# EAGLE schematic rc2014_can_controller (EAGLE 7.6.0)
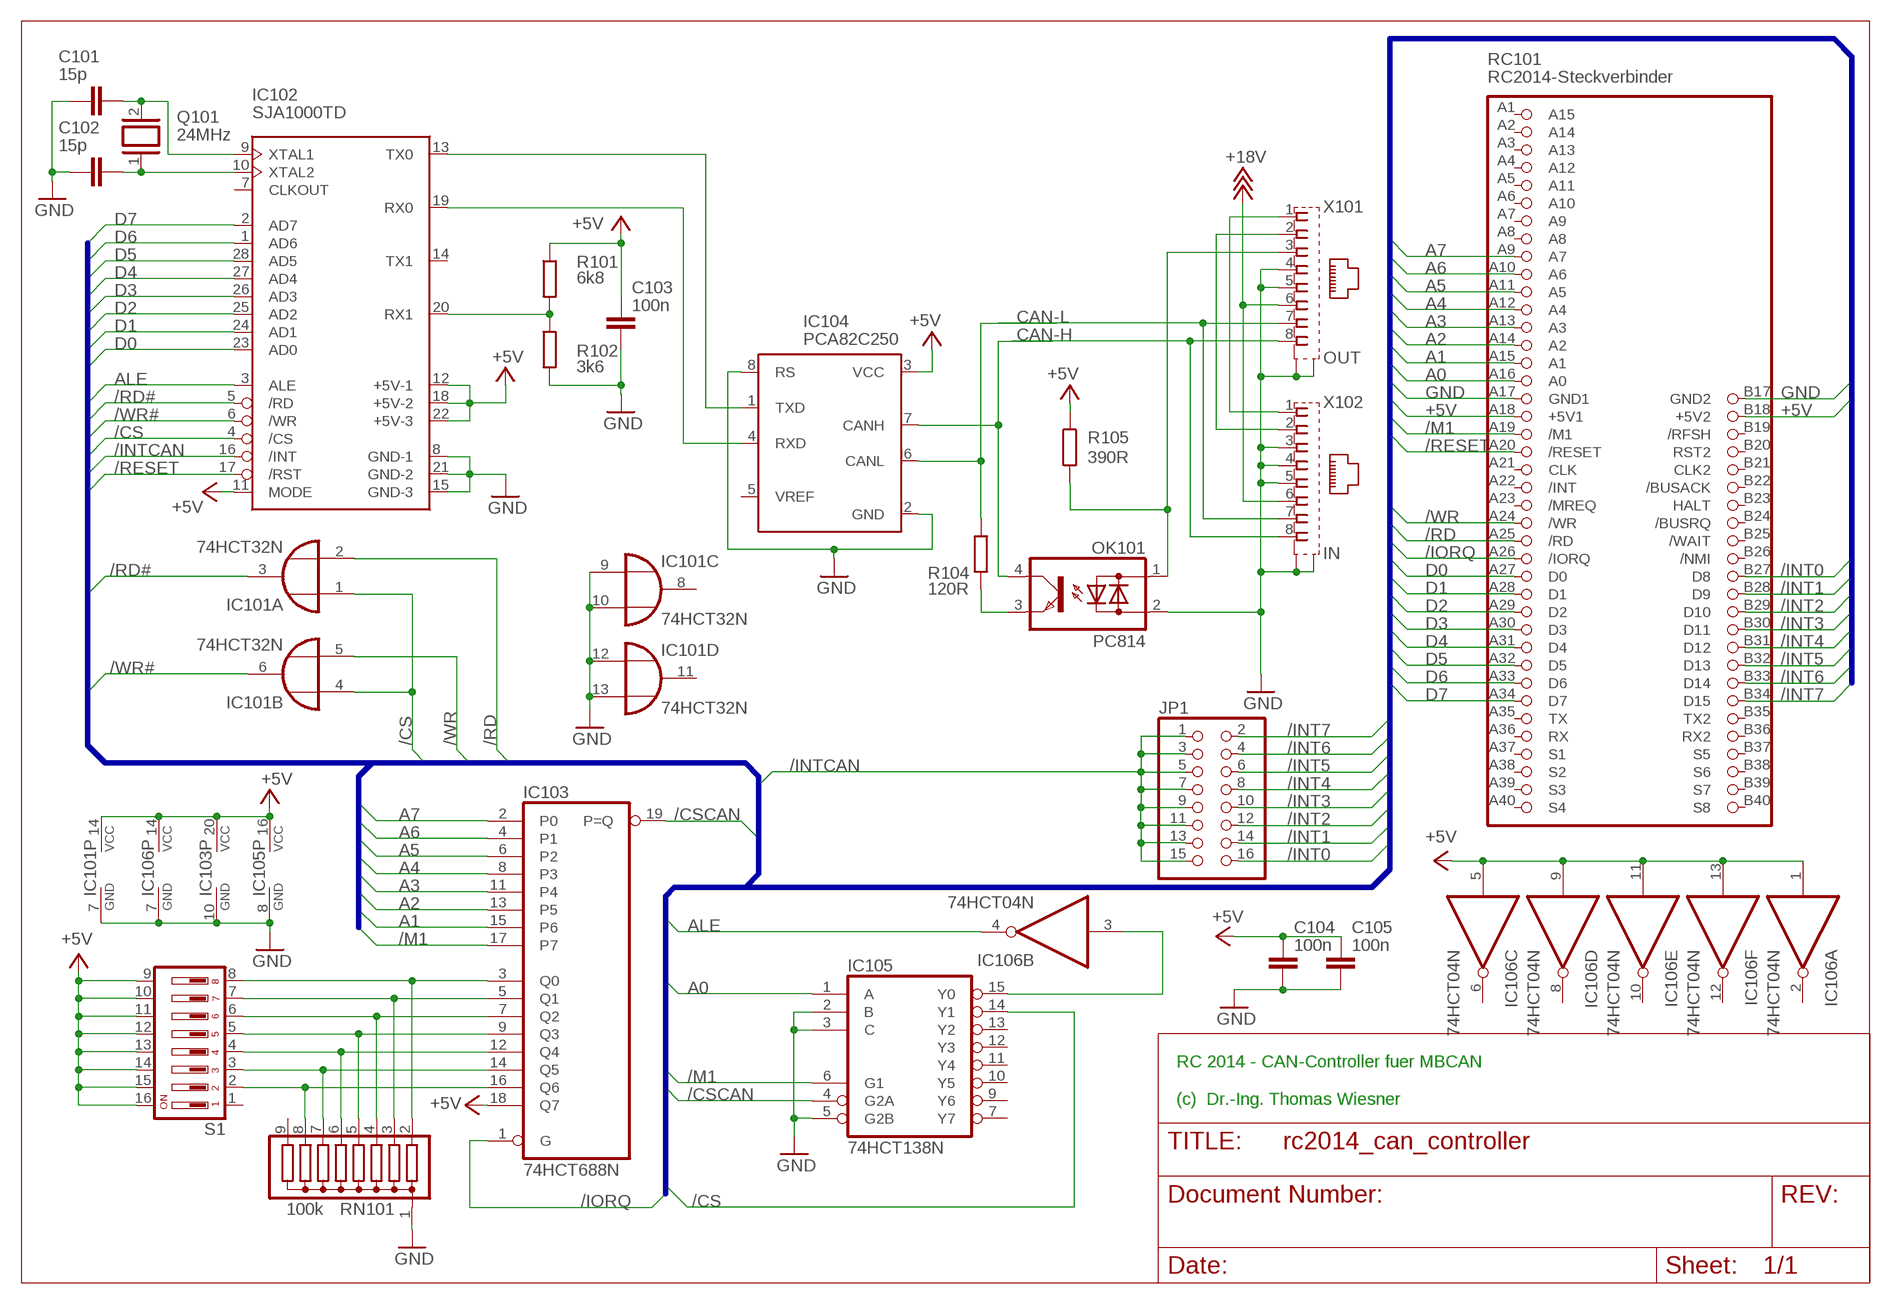
[diagram p0: schematic, sheet 1]

## Parts
C101  15p  C-EU025-025X050  [C025-025X050]
C102  15p  C-EU025-025X050  [C025-025X050]
C103  100n  C-EU025-025X050  [C025-025X050]
C104  100n  C-EU025-025X050  [C025-025X050]
C105  100n  C-EU025-025X050  [C025-025X050]
IC101  74HCT32N  [DIL14]
IC102  SJA1000TD  [DIL28]
IC103  74HCT688N  [DIL20]
IC104  PCA82C250  [DIL08]
IC105  74HCT138N  74ACT138N  [DIL16]
IC106  74HCT04N  [DIL14]
JP1  PINHD-2X8  [2X08]
OK101  PC814  [DIL04]
Q101  24MHz  XTAL/S  [QS]
R101  6k8  R-EU_0207/10  [0207/10]
R102  3k6  R-EU_0207/10  [0207/10]
R104  120R  R-EU_0207/10  [0207/10]
R105  390R  R-EU_0207/10  [0207/10]
RC101  RC2014-Steckverbinder  RC2014STECKER  [RC2014-STECKER]
RN101  100k  G08R  [SIL9]
S1  DS08  [DS-08]
X101  OUT  0446200002  [0446200002]
X102  IN  0446200002  [0446200002]

## Nets
+5V: C103.2 C104.2 C105.2 IC101.14(P:VCC) IC102.11(MODE) IC102.12(+5V-1) IC102.18(+5V-2) IC102.22(+5V-3) IC103.18(Q7) IC103.20(VCC) IC104.3(VCC) IC105.16(VCC) IC106.1(A:I) IC106.5(C:I) IC106.9(D:I) IC106.11(E:I) IC106.13(F:I) IC106.14(P:VCC) R101.1 R105.1 RC101.A18(+5V1) RC101.B18(+5V2) S1.9 S1.10 S1.11 S1.12 S1.13 S1.14 S1.15 S1.16
+18V: X101.6 X102.6
/ALE: IC105.15(Y0) IC106.3(B:I)
/CS: IC101.1(A:I0) IC101.4(B:I0) IC102.4(/CS) IC105.14(Y1)
/CSCAN: IC103.19(P=Q) IC105.4(G2A)
/INT0: JP1.16 RC101.B27(D8)
/INT1: JP1.14 RC101.B28(D9)
/INT2: JP1.12 RC101.B29(D10)
/INT3: JP1.10 RC101.B30(D11)
/INT4: JP1.8 RC101.B31(D12)
/INT5: JP1.6 RC101.B32(D13)
/INT6: JP1.4 RC101.B33(D14)
/INT7: JP1.2 RC101.B34(D15)
/INTCAN: IC102.16(/INT) JP1.1 JP1.3 JP1.5 JP1.7 JP1.9 JP1.11 JP1.13 JP1.15
/IORQ: IC103.1(G) RC101.A26(/IORQ)
/M1: IC103.17(P7) IC105.6(G1) RC101.A19(/M1)
/RD: IC101.2(A:I1) RC101.A25(/RD)
/RD#: IC101.3(A:O) IC102.5(/RD)
/RESET: IC102.17(/RST) RC101.A20(/RESET)
/WR: IC101.5(B:I1) RC101.A24(/WR)
/WR#: IC101.6(B:O) IC102.6(/WR)
A0: IC105.1(A) RC101.A16(A0)
A1: IC103.15(P6) RC101.A15(A1)
A2: IC103.13(P5) RC101.A14(A2)
A3: IC103.11(P4) RC101.A13(A3)
A4: IC103.8(P3) RC101.A12(A4)
A5: IC103.6(P2) RC101.A11(A5)
A6: IC103.4(P1) RC101.A10(A6)
A7: IC103.2(P0) RC101.A9(A7)
ALE: IC102.3(ALE) IC106.4(B:O)
CAN-H: IC104.7(CANH) OK101.4(C) X101.8 X102.8
CAN-L: IC104.6(CANL) R104.2 X101.7 X102.7
D0: IC102.23(AD0) RC101.A27(D0)
D1: IC102.24(AD1) RC101.A28(D1)
D2: IC102.25(AD2) RC101.A29(D2)
D3: IC102.26(AD3) RC101.A30(D3)
D4: IC102.27(AD4) RC101.A31(D4)
D5: IC102.28(AD5) RC101.A32(D5)
D6: IC102.1(AD6) RC101.A33(D6)
D7: IC102.2(AD7) RC101.A34(D7)
GND: C101.2 C102.2 C103.1 C104.1 C105.1 IC101.7(P:GND) IC101.9(C:I0) IC101.10(C:I1) IC101.12(D:I0) IC101.13(D:I1) IC102.8(GND-1) IC102.15(GND-3) IC102.21(GND-2) IC103.10(GND) IC104.2(GND) IC104.8(RS) IC105.2(B) IC105.3(C) IC105.5(G2B) IC105.8(GND) IC106.7(P:GND) OK101.2(AC2) R102.1 RC101.A17(GND1) RC101.B17(GND2) RN101.1 X101.4 X101.5 X101.S@1(S1) X101.S@2(S2) X102.3 X102.4 X102.5 X102.S@1(S1) X102.S@2(S2)
N$1: OK101.1(AC1) R105.2 X101.3
N$2: C101.1 IC102.9(XTAL1) Q101.2
N$3: OK101.3(E) R104.1
N$4: C102.1 IC102.10(XTAL2) Q101.1
N$6: IC103.16(Q6) RN101.8 S1.2
N$7: IC103.14(Q5) RN101.7 S1.3
N$8: IC103.12(Q4) RN101.6 S1.4
N$9: IC103.9(Q3) RN101.5 S1.5
N$10: IC103.7(Q2) RN101.4 S1.6
N$11: IC103.5(Q1) RN101.3 S1.7
N$12: X101.2 X102.2
N$13: X101.1 X102.1
N$16: IC103.3(Q0) RN101.2 S1.8
N$39: IC102.20(RX1) R101.2 R102.2
RX: IC102.19(RX0) IC104.4(RXD)
TX: IC102.13(TX0) IC104.1(TXD)
Unconnected: IC101.8(C:O) IC101.11(D:O) IC102.7(CLKOUT) IC102.14(TX1) IC104.5(VREF) IC105.7(Y7) IC105.9(Y6) IC105.10(Y5) IC105.11(Y4) IC105.12(Y3) IC105.13(Y2) IC106.2(A:O) IC106.6(C:O) IC106.8(D:O) IC106.10(E:O) IC106.12(F:O) RC101.A1(A15) RC101.A2(A14) RC101.A3(A13) RC101.A4(A12) RC101.A5(A11) RC101.A6(A10) RC101.A7(A9) RC101.A8 RC101.A21(CLK) RC101.A22(/INT) RC101.A23(/MREQ) RC101.A35(TX) RC101.A36(RX) RC101.A37(S1) RC101.A38(S2) RC101.A39(S3) RC101.A40(S4) RC101.B19(/RFSH) RC101.B20(RST2) RC101.B21(CLK2) RC101.B22(/BUSACK) RC101.B23(HALT) RC101.B24(/BUSRQ) RC101.B25(/WAIT) RC101.B26(/NMI) RC101.B35(TX2) RC101.B36(RX2) RC101.B37(S5) RC101.B38(S6) RC101.B39(S7) RC101.B40(S8) RN101.9 S1.1

## Buses
B$1
B$2

## Notes on the sheet
- RC 2014 - CAN-Controller fuer MBCAN
  
  (c)  Dr.-Ing. Thomas Wiesner

## Library data of the parts
C101-C105 = rcl:C-EU: CAPACITOR, European symbol
IC101 = 74xx-eu:74*32: Quad 2-input OR gate
IC102 = mbc:SJA1000: BASIC-CAN 2.0a Controller (former 82C200) Stand-alone CAN controller
IC103 = 74xx-eu:74*688: 8-bit MAGNITUDE/IDENTITY COMPARATOR, totem pole
IC104 = micro-philips:PCA82C250: CAN CONTROLLER INTERFACE; OC_FARNELL: 3692358; OC_NEWARK: unknown
IC105 = 74xx-eu:74*138: 3-line to 8-line DECODER/DEMULTIPLEXER
IC106 = 74xx-eu:74*04: Hex INVERTER
JP1 = pinhead:PINHD-2X8: PIN HEADER
OK101 = optocoupler:PC814: SHARP OPTO COUPLER; OC_FARNELL: 9707662; OC_NEWARK: unknown
Q101 = special:XTAL/S: CRYSTAL
R101 R102 R104 R105 = resistor:R-EU_: RESISTOR, European symbol
RC101 = mbc:RC2014: RC-2014-Steckverbinder Modul
RN101 = resistor-sil:G08R: SIL RESISTOR; OC_FARNELL: unknown; OC_NEWARK: unknown
S1 = switch-dil:DS08: DIL/CODE SWITCH; MPN: DS08; OC_FARNELL: unknown; OC_NEWARK: 73J0071
X101 X102 = mbc:0446200002: RJ-45 INVERTED MODULAR JACK ASSEMBLY WITH RJ-11 KEEPOUT FEATURE Source: Data sheet <http://www.farnell.com/datasheets/73207.pdf> MOLEX 0446200002 BUCHSE, RJ45, GESCHIRMT Source: Farnell <http://de.farnell.com/molex/0446200002/buchse-rj45-geschirmt/dp/9251910?ost=9251910>; MF: MOLEX; MPN: 0446200002; OC_FARNELL: 9251910